# Altium schematic sheet baseboardV0.1Part1.SchDoc
size A4
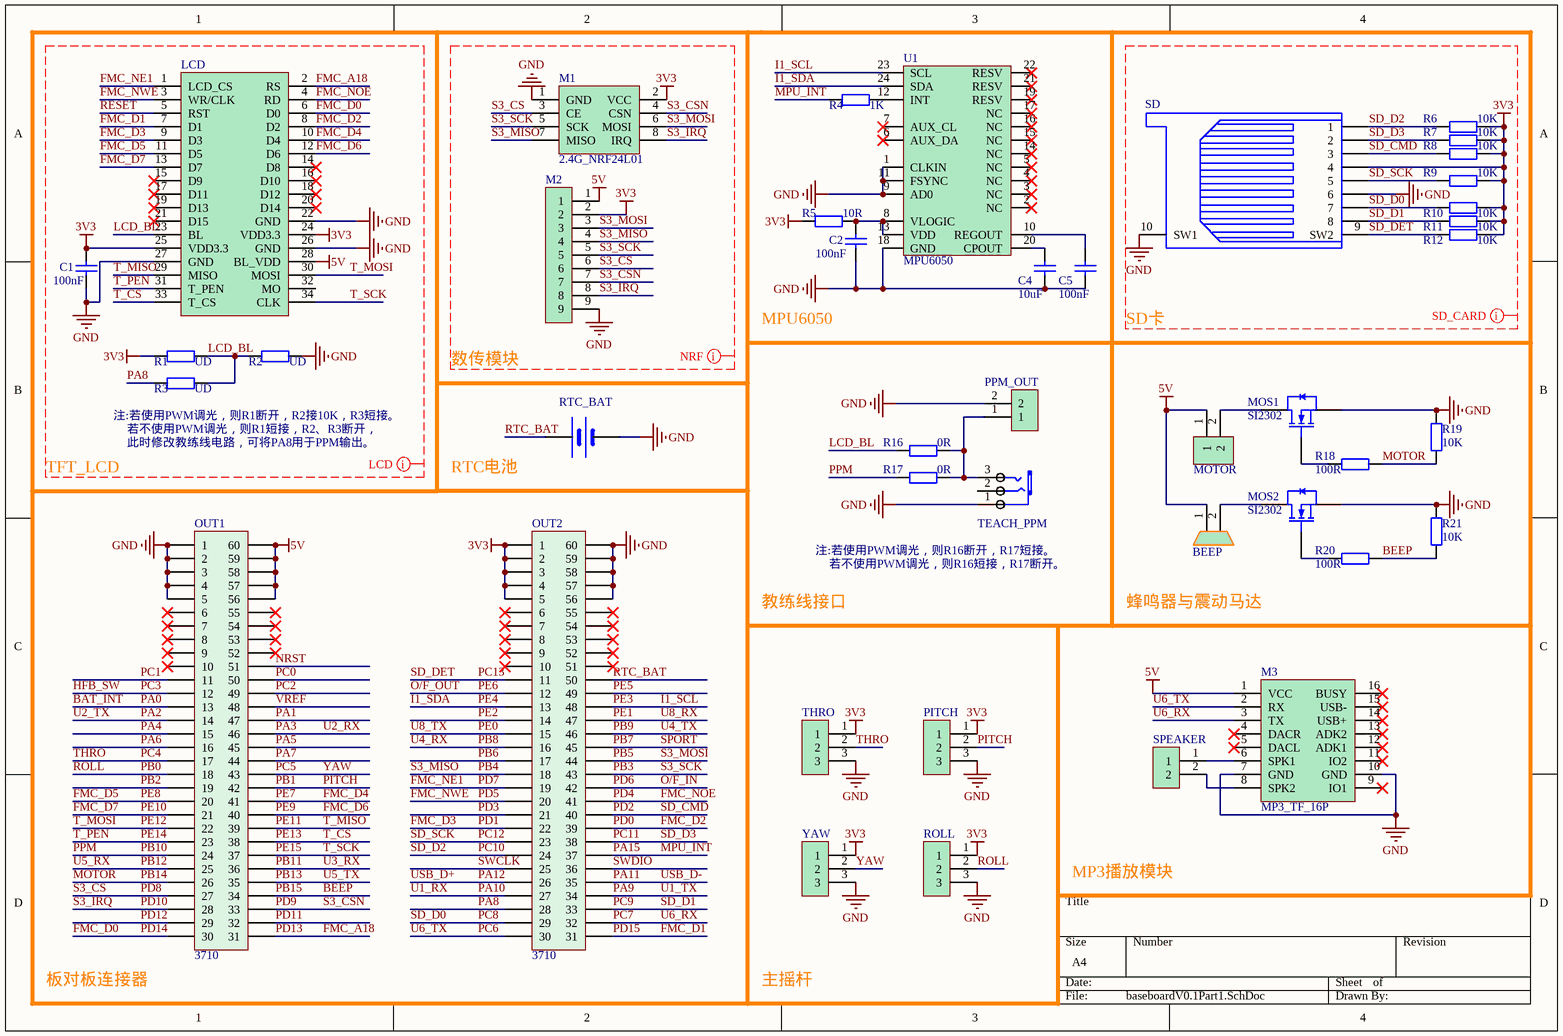
[diagram p0: baseboardV0.1Part1.SchDoc]

## Parts
BEEP  BEEP_5020_SMT  [BEEP_5020_SMT]  (value not drawn)
C1  100nF  [0603_C]
C2  100nF  [0603_C]
C4  10uF  [0603_C]
C5  100nF  [0603_C]
LCD  LCD_3.5_480*320_SMT  [LCD_3.5_480*320_SMT]  (value not drawn)
M1  2.4G_NRF24L01  [2.4G_NRF24L01]
M2  SH1.25mm_9P  [SH1.25MM_9P]  (value not drawn)
M3  MP3_TF_16P  [MP3_TF_16P]
MOS1  SI2302  [SOT23]
MOS2  SI2302  [SOT23]
MOTOR  SH1.25mm_2P  [SH1.25mm_2P]  (value not drawn)
OUT1  3710  [3710F060046G3FT01]
OUT2  3710  [3710F060046G3FT01]
PITCH  pitch  [SH1.25mm_3P]  (value not drawn)
PPM_OUT  SH1.25mm_2P  [SH1.25mm_2P]  (value not drawn)
R1  UD  [0603_R]
R2  UD  [0603_R]
R3  UD  [0603_R]
R4  1K  [0603_R]
R5  10R  [0603_R]
R6  10K  [0603_R]
R7  10K  [0603_R]
R8  10K  [0603_R]
R9  10K  [0603_R]
R10  10K  [0603_R]
R11  10K  [0603_R]
R12  10K  [0603_R]
R16  0R  [0603_R]
R17  0R  [0603_R]
R18  100R  [0603_R]
R19  10K  [0603_R]
R20  100R  [0603_R]
R21  10K  [0603_R]
ROLL  roll  [SH1.25mm_3P]  (value not drawn)
RTC_BAT  CR1220_BATTERY  [CR1220_BATTERY]  (value not drawn)
SD  TF_Card  [TF_card]  (value not drawn)
SPEAKER  SH1.25mm_2P  [SH1.25mm_2P]  (value not drawn)
TEACH_PPM  AUDIO_PJ313D  [AUDIO_PJ313D]  (value not drawn)
THRO  thro  [SH1.25mm_3P]  (value not drawn)
U1  MPU6050  [QFN24]
YAW  yaw  [SH1.25mm_3P]  (value not drawn)

## Nets
3V3: C1.2 LCD.24(VDD3.3) LCD.25(VDD3.3) M1.2(VCC) M2.2 OUT2.1 OUT2.2 OUT2.3 OUT2.4 OUT2.5 PITCH.1 R1.1 R5.1 R6.2 R7.2 R8.2 R9.2 R10.2 R11.2 R12.2 ROLL.1 SD.4 THRO.1 YAW.1
5V: BEEP.1 LCD.28(BL_VDD) M2.1 M3.1(VCC) MOTOR.1 OUT1.56 OUT1.57 OUT1.58 OUT1.59 OUT1.60
GND: C1.1 C2.1 C4.2 C5.2 LCD.22(GND) LCD.26(GND) LCD.27(GND) M1.1(GND) M2.9 M3.7(GND) M3.10(GND) MOS1.2(S) MOS2.2(S) OUT1.1 OUT1.2 OUT1.3 OUT1.4 OUT1.5 OUT2.56 OUT2.57 OUT2.58 OUT2.59 OUT2.60 PITCH.3 PPM_OUT.2 R2.2 R19.2 R21.2 ROLL.3 RTC_BAT.2(GND) SD.6 SD.10(SW1) TEACH_PPM.1(COM) THRO.3 U1.1(CLKIN) U1.9(AD0) U1.11(FSYNC) U1.18(GND) YAW.3
BAT_INT: OUT1.13  [also labelled PA0]
BEEP: OUT1.34 R20.2 R21.1  [also labelled PB15]
FMC_A18: LCD.2(RS) OUT1.31  [also labelled PD13]
FMC_D0: LCD.6(D0) OUT1.30  [also labelled PD14]
FMC_D1: LCD.7(D1) OUT2.31  [also labelled PD15]
FMC_D2: LCD.8(D2) OUT2.39  [also labelled PD0]
FMC_D3: LCD.9(D3) OUT2.22  [also labelled PD1]
FMC_D4: LCD.10(D4) OUT1.41  [also labelled PE7]
FMC_D5: LCD.11(D5) OUT1.20  [also labelled PE8]
FMC_D6: LCD.12(D6) OUT1.40  [also labelled PE9]
FMC_D7: LCD.13(D7) OUT1.21  [also labelled PE10]
FMC_NE1: LCD.1(LCD_CS) OUT2.19  [also labelled PD7]
FMC_NOE: LCD.4(RD) OUT2.41  [also labelled PD4]
FMC_NWE: LCD.3(WR/CLK) OUT2.20  [also labelled PD5]
HFB_SW: OUT1.12  [also labelled PC3]
I1_SCL: OUT2.48 U1.23(SCL)  [also labelled PE3]
I1_SDA: OUT2.13 U1.24(SDA)  [also labelled PE4]
LCD_BL: LCD.23(BL) R1.2 R2.1 R3.2 R16.2
MOTOR: OUT1.26 R18.2 R19.1  [also labelled PB14]
MPU_INT: OUT2.37 R4.1  [also labelled PA15]
NRST: OUT1.51
O/F_IN: OUT2.42  [also labelled PD6]
O/F_OUT: OUT2.12  [also labelled PE6]
PA1: OUT1.47
PA2: OUT1.14  [also labelled U2_TX]
PA3: OUT1.46  [also labelled U2_RX]
PA4: OUT1.15
PA5: OUT1.45
PA6: OUT1.16
PA7: OUT1.44
PA8: OUT2.28 R3.1
PA9: OUT2.34  [also labelled U1_TX]
PA10: OUT2.27  [also labelled U1_RX]
PA11: OUT2.35  [also labelled USB_D-]
PA12: OUT2.26  [also labelled USB_D+]
PB0: OUT1.18 ROLL.2  [also labelled ROLL]
PB1: OUT1.42 PITCH.2  [also labelled PITCH]
PB2: OUT1.19
PB3: M1.5(SCK) M2.5 OUT2.43  [also labelled S3_SCK]
PB4: M1.7(MISO) M2.4 OUT2.18  [also labelled S3_MISO]
PB5: M1.6(MOSI) M2.3 OUT2.44  [also labelled S3_MOSI]
PB6: OUT2.17
PB7: OUT2.45  [also labelled SPORT]
PB8: OUT2.16  [also labelled U4_RX]
PB9: OUT2.46  [also labelled U4_TX]
PB10: OUT1.24 R17.2  [also labelled PPM]
PB11: OUT1.36  [also labelled U3_RX]
PB12: OUT1.25  [also labelled U5_RX]
PB13: OUT1.35  [also labelled U5_TX]
PC0: OUT1.50
PC1: OUT1.11
PC2: OUT1.49
PC4: OUT1.17 THRO.2  [also labelled THRO]
PC5: OUT1.43 YAW.2  [also labelled YAW]
PC6: M3.2(RX) OUT2.30  [also labelled U6_TX]
PC7: M3.3(TX) OUT2.32  [also labelled U6_RX]
PC8: OUT2.29 R10.1 SD.7  [also labelled SD_D0]
PC9: OUT2.33 R11.1 SD.8  [also labelled SD_D1]
PC10: OUT2.24 R6.1 SD.1  [also labelled SD_D2]
PC11: OUT2.38 R7.1 SD.2  [also labelled SD_D3]
PC12: OUT2.23 R9.1 SD.5  [also labelled SD_SCK]
PC13: OUT2.11 R12.1 SD.9(SW2)  [also labelled SD_DET]
PD2: OUT2.40 R8.1 SD.3  [also labelled SD_CMD]
PD3: OUT2.21
PD8: M1.3(CE) M2.6 OUT1.27  [also labelled S3_CS]
PD9: M1.4(CSN) M2.7 OUT1.33  [also labelled S3_CSN]
PD10: M1.8(IRQ) M2.8 OUT1.28  [also labelled S3_IRQ]
PD11: OUT1.32
PD12: OUT1.29
PE0: OUT2.15  [also labelled U8_TX]
PE1: OUT2.47  [also labelled U8_RX]
PE2: OUT2.14
PE5: OUT2.49
PE11: LCD.29(MISO) OUT1.39  [also labelled T_MISO]
PE12: LCD.30(MOSI) OUT1.22  [also labelled T_MOSI]
PE13: LCD.33(T_CS) OUT1.38  [also labelled T_CS]
PE14: LCD.31(T_PEN) OUT1.23  [also labelled T_PEN]
PE15: LCD.34(CLK) OUT1.37  [also labelled T_SCK]
RESET: LCD.5(RST)
RTC_BAT: OUT2.50 RTC_BAT.1(VCC)
SWCLK: OUT2.25
SWDIO: OUT2.36
VREF: OUT1.48
NetBEEP_2: BEEP.2 MOS2.3(D)
NetC2_2: C2.2 R5.2 U1.8(VLOGIC) U1.13(VDD)
NetC4_1: C4.1 U1.20(CPOUT)
NetC5_1: C5.1 U1.10(REGOUT)
NetM3_6: M3.6(SPK1) SPEAKER.1
NetM3_8: M3.8(SPK2) SPEAKER.2
NetMOS1_1: MOS1.1(G) R18.1
NetMOS1_3: MOS1.3(D) MOTOR.2
NetMOS2_1: MOS2.1(G) R20.1
NetPPM_OUT_1: PPM_OUT.1 R16.1 R17.1 TEACH_PPM.3(CHL)
NetR4_2: R4.2 U1.12(INT)

Not connected (* = marked no-connect by the designer): LCD 14(D8)* 15(D9)* 16(D10)* 17(D11)* 18(D12)* 19(D13)* 20(D14)* 21(D15)* 32(MO); M3 4(DACR)* 5(DACL)* 9(IO1)* 11(IO2)* 12(ADK1)* 13(ADK2)* 14(USB+)* 15(USB-)* 16(BUSY)*; OUT1 6* 7* 8* 9* 10* 52* 53* 54* 55*; OUT2 6* 7* 8* 9* 10* 51* 52* 53* 54* 55*; TEACH_PPM 2(CHR); U1 2(NC)* 3(NC)* 4(NC)* 5(NC)* 6(AUX_DA)* 7(AUX_CL)* 14(NC)* 15(NC)* 16(NC)* 17(NC)* 19(RESV)* 21(RESV)* 22(RESV)*

## Layout directives
net class LCD: 3V3, 5V, FMC_A18, FMC_D0, FMC_D1, FMC_D2, FMC_D3, FMC_D4, FMC_D5, FMC_D6, FMC_D7, FMC_NE1, FMC_NOE, FMC_NWE, GND, LCD_BL, PA8, RESET, T_CS, T_MISO, T_MOSI, T_PEN, T_SCK
net class SD_CARD: 3V3, GND, SD_CMD, SD_D0, SD_D1, SD_D2, SD_D3, SD_DET, SD_SCK
net class NRF: 3V3, 5V, GND, S3_CS, S3_CSN, S3_IRQ, S3_MISO, S3_MOSI, S3_SCK

## Notes on the sheet
- 数传模块
- MPU6050
- SD卡
- (near R3) 注:若使用PWM调光，则R1断开，R2接10K，R3短接。
- (near R3) 若不使用PWM调光，则R1短接，R2、R3断开，
- 此时修改教练线电路，可将PA8用于PPM输出。
- TFT_LCD
- RTC电池
- 注:若使用PWM调光，则R16断开，R17短接。
- 若不使用PWM调光，则R16短接，R17断开。
- 教练线接口
- 蜂鸣器与震动马达
- MP3播放模块
- 板对板连接器
- 主摇杆

## Library data of the parts
C1 C2 C4 C5 = 0603_CAP
MOS1 MOS2 = MOSN_SI2302_SOT23
OUT1 OUT2 = 3710F_30*2pin
PITCH ROLL THRO YAW = SH1.25mm_3P
R1-R12 R16-R21 = 0603_RES